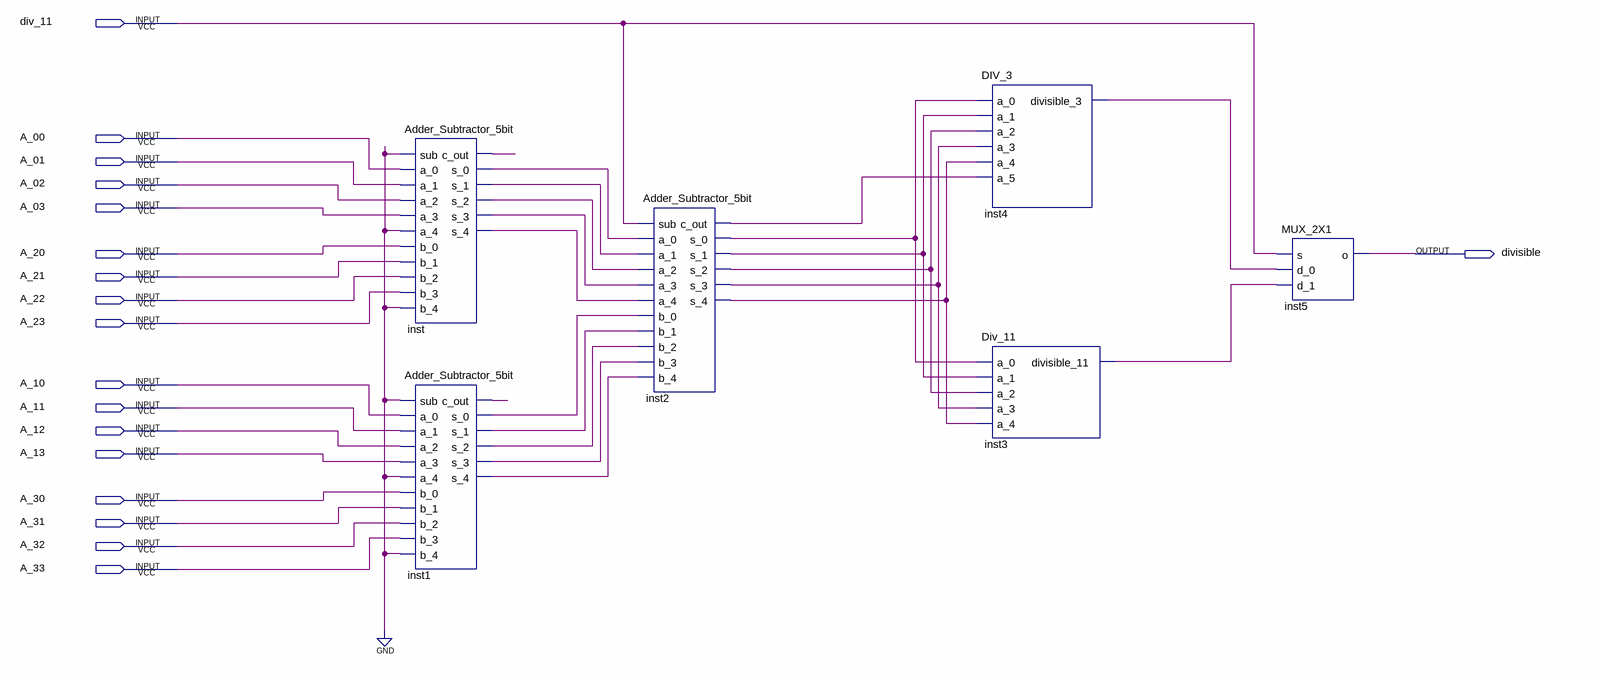
[diagram p0: schematic sheet]
// Quartus schematic top_module.bdf as structural Verilog: 6 symbols, 18 pins
module top_module (
  input  div_11,
  input  A_00,
  input  A_01,
  input  A_02,
  input  A_03,
  input  A_20,
  input  A_21,
  input  A_22,
  input  A_23,
  input  A_10,
  input  A_11,
  input  A_12,
  input  A_13,
  input  A_30,
  input  A_31,
  input  A_32,
  input  A_33,
  output divisible
);

  wire inst1_c_out, inst1_s_0, inst1_s_1, inst1_s_2, inst1_s_3, inst1_s_4, inst2_c_out, inst2_s_0, inst2_s_1,
       inst2_s_2, inst2_s_3, inst2_s_4, inst3_divisible_11, inst4_divisible_3, inst_c_out, inst_s_0,
       inst_s_1, inst_s_2, inst_s_3, inst_s_4;

  Adder_Subtractor_5bit inst (
    .sub(1'b0), .a_0(A_00), .a_1(A_01), .a_2(A_02), .a_3(A_03), .a_4(1'b0), .b_0(A_20), .b_1(A_21),
    .b_2(A_22), .b_3(A_23), .b_4(1'b0), .c_out(inst_c_out), .s_0(inst_s_0), .s_1(inst_s_1), .s_2(inst_s_2),
    .s_3(inst_s_3), .s_4(inst_s_4));
  Adder_Subtractor_5bit inst1 (
    .sub(1'b0), .a_0(A_10), .a_1(A_11), .a_2(A_12), .a_3(A_13), .a_4(1'b0), .b_0(A_30), .b_1(A_31),
    .b_2(A_32), .b_3(A_33), .b_4(1'b0), .c_out(inst1_c_out), .s_0(inst1_s_0), .s_1(inst1_s_1),
    .s_2(inst1_s_2), .s_3(inst1_s_3), .s_4(inst1_s_4));
  Adder_Subtractor_5bit inst2 (
    .sub(div_11), .a_0(inst_s_0), .a_1(inst_s_1), .a_2(inst_s_2), .a_3(inst_s_3), .a_4(inst_s_4),
    .b_0(inst1_s_0), .b_1(inst1_s_1), .b_2(inst1_s_2), .b_3(inst1_s_3), .b_4(inst1_s_4), .c_out(inst2_c_out),
    .s_0(inst2_s_0), .s_1(inst2_s_1), .s_2(inst2_s_2), .s_3(inst2_s_3), .s_4(inst2_s_4));
  DIV_3 inst4 (
    .a_0(inst2_s_0), .a_1(inst2_s_1), .a_2(inst2_s_2), .a_3(inst2_s_3), .a_4(inst2_s_4), .a_5(inst2_c_out),
    .divisible_3(inst4_divisible_3));
  Div_11 inst3 (
    .a_0(inst2_s_0), .a_1(inst2_s_1), .a_2(inst2_s_2), .a_3(inst2_s_3), .a_4(inst2_s_4),
    .divisible_11(inst3_divisible_11));
  MUX_2X1 inst5 (.s(div_11), .d_0(inst4_divisible_3), .d_1(inst3_divisible_11), .o(divisible));
endmodule
